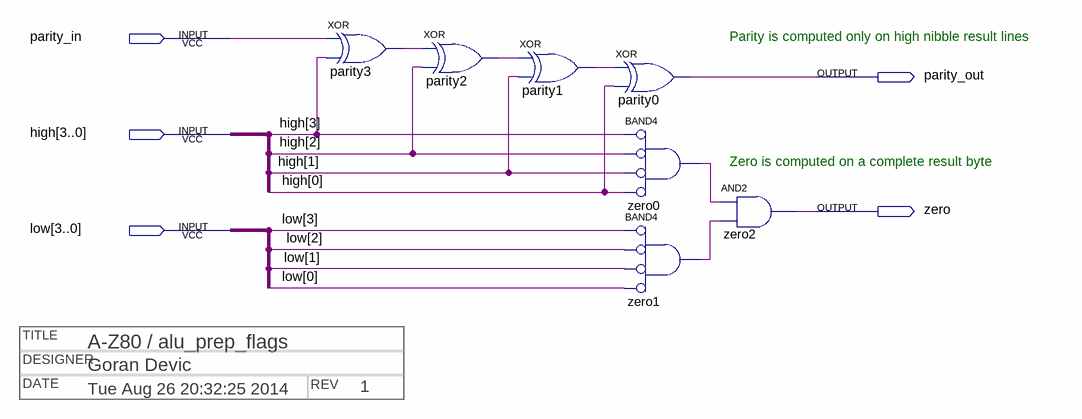
[diagram p0: schematic sheet]
// Quartus schematic alu_prep_flags.bdf as structural Verilog: 7 symbols, 5 pins
// Title block: TITLE: A-Z80 / alu_prep_flags; DESIGNER: Goran Devic; DATE: Tue Aug 26 20:32:25 2014; REV: 1
module alu_prep_flags (
  input  parity_in,
  input  [3:0] high,
  input  [3:0] low,
  output parity_out,
  output zero
);

  wire parity1_out, parity2_out, parity3_out, zero0_out, zero1_out;

  xor parity3 (parity3_out, parity_in, high[3]);
  xor parity2 (parity2_out, parity3_out, high[2]);
  xor parity1 (parity1_out, parity2_out, high[1]);
  xor parity0 (parity_out, parity1_out, high[0]);
  and zero0 (zero0_out, ~high[3], ~high[2], ~high[1], ~high[0]);  // BAND4
  and zero1 (zero1_out, ~low[3], ~low[2], ~low[1], ~low[0]);  // BAND4
  and zero2 (zero, zero0_out, zero1_out);

  // Notes on the sheet:
  //   Parity is computed only on high nibble result lines
  //   Zero is computed on a complete result byte
endmodule
